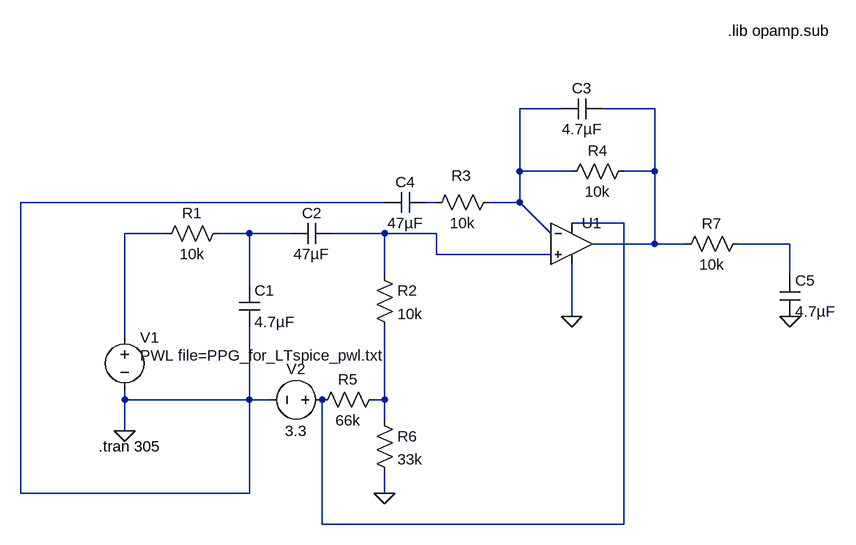
[diagram p0: schematic PPG_Filter.asc]
PPG_Filter.asc, the LTspice schematic file:
Version 4.1
SHEET 1 1164 680
WIRE 736 -192 672 -192
WIRE 880 -192 800 -192
WIRE 672 -96 672 -192
WIRE 752 -96 672 -96
WIRE 880 -96 880 -192
WIRE 880 -96 832 -96
WIRE 464 -48 -96 -48
WIRE 544 -48 528 -48
WIRE 672 -48 672 -96
WIRE 672 -48 624 -48
WIRE 832 -16 752 -16
WIRE 128 0 64 0
WIRE 256 0 208 0
WIRE 320 0 256 0
WIRE 464 0 384 0
WIRE 544 0 464 0
WIRE 720 0 672 -48
WIRE 880 16 880 -96
WIRE 880 16 784 16
WIRE 928 16 880 16
WIRE 1088 16 1008 16
WIRE 544 32 544 0
WIRE 720 32 544 32
WIRE 464 64 464 0
WIRE 1088 64 1088 16
WIRE 256 80 256 0
WIRE 752 128 752 48
WIRE 64 160 64 0
WIRE 64 256 64 240
WIRE 256 256 256 144
WIRE 256 256 64 256
WIRE 288 256 256 256
WIRE 464 256 464 144
WIRE 464 256 448 256
WIRE 464 288 464 256
WIRE 64 304 64 256
WIRE -96 400 -96 -48
WIRE 256 400 256 256
WIRE 256 400 -96 400
WIRE 464 400 464 368
WIRE 368 448 368 256
WIRE 832 448 832 -16
WIRE 832 448 368 448
FLAG 64 304 0
FLAG 752 128 0
FLAG 1088 128 0
FLAG 464 400 0
SYMBOL voltage 64 144 R0
WINDOW 3 24 44 Left 2
WINDOW 123 0 0 Left 0
WINDOW 39 0 0 Left 0
SYMATTR Value PWL file=PPG_for_LTspice_pwl.txt
SYMATTR InstName V1
SYMBOL cap 240 80 R0
SYMATTR InstName C1
SYMATTR Value 4.7µF
SYMBOL res 224 -16 R90
WINDOW 0 0 56 VBottom 2
WINDOW 3 32 56 VTop 2
SYMATTR InstName R1
SYMATTR Value 10k
SYMBOL cap 384 -16 R90
WINDOW 0 0 32 VBottom 2
WINDOW 3 32 32 VTop 2
SYMATTR InstName C2
SYMATTR Value 47µF
SYMBOL res 640 -64 R90
WINDOW 0 -10 58 VBottom 2
WINDOW 3 32 56 VTop 2
SYMATTR InstName R3
SYMATTR Value 10k
SYMBOL res 848 -112 R90
WINDOW 0 0 56 VBottom 2
WINDOW 3 32 56 VTop 2
SYMATTR InstName R4
SYMATTR Value 10k
SYMBOL OpAmps\\UniversalOpAmp2 752 16 R0
SYMATTR InstName U1
SYMBOL cap 800 -208 R90
WINDOW 0 0 32 VBottom 2
WINDOW 3 32 32 VTop 2
SYMATTR InstName C3
SYMATTR Value 4.7µF
SYMBOL res 448 48 R0
SYMATTR InstName R2
SYMATTR Value 10k
SYMBOL voltage 384 256 R90
WINDOW 0 -32 56 VBottom 2
WINDOW 3 32 56 VTop 2
WINDOW 123 0 0 Left 0
WINDOW 39 0 0 Left 0
SYMATTR InstName V2
SYMATTR Value 3.3
SYMBOL res 464 240 R90
WINDOW 0 0 56 VBottom 2
WINDOW 3 32 56 VTop 2
SYMATTR InstName R5
SYMATTR Value 66k
SYMBOL cap 528 -64 R90
WINDOW 0 0 32 VBottom 2
WINDOW 3 32 32 VTop 2
SYMATTR InstName C4
SYMATTR Value 47µF
SYMBOL res 448 272 R0
SYMATTR InstName R6
SYMATTR Value 33k
SYMBOL res 1024 0 R90
WINDOW 0 0 56 VBottom 2
WINDOW 3 32 56 VTop 2
SYMATTR InstName R7
SYMATTR Value 10k
SYMBOL cap 1072 64 R0
SYMATTR InstName C5
SYMATTR Value 4.7µF
TEXT 24 328 Left 2 !.tran 305
TEXT 992 -312 Left 2 !.lib opamp.sub

The netlist it stands for:
* PPG_Filter.asc
V1 N005 0 PWL file=PPG_for_LTspice_pwl.txt
C1 N006 0 4.7µF
R1 N006 N005 10k
C2 N007 N006 47µF
R3 N001 N003 10k
R4 N002 N001 10k
X§U1 N007 N001 N004 0 N002 level2 Avol=1Meg GBW=10Meg Slew=10Meg Ilimit=25m Rail=0 Vos=0 En=0 Enk=0 In=0 Ink=0 Rin=500Meg  ; pins In+ In- V+ V- OUT
C3 N002 N001 4.7µF
R2 N007 N009 10k
V2 N004 0 3.3
R5 N009 N004 66k
C4 N003 0 47µF
R6 N009 0 33k
R7 N008 N002 10k
C5 N008 0 4.7µF
.tran 305
.lib opamp.sub
.lib UniversalOpAmp2.lib
.backanno
.end